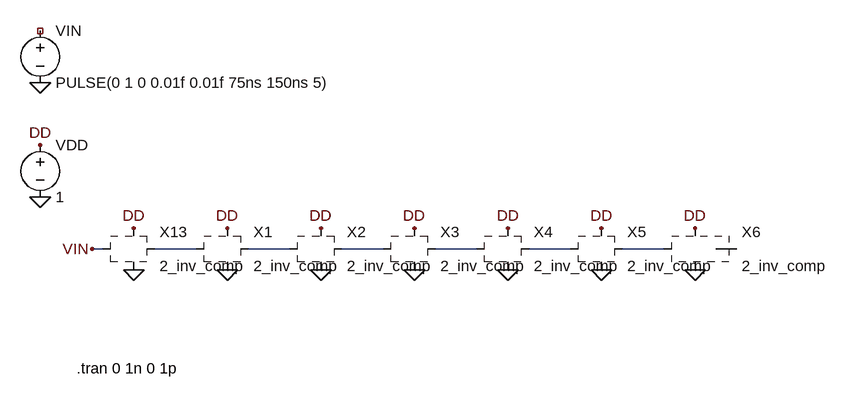
[diagram p0: schematic 2_circuito.asc]
2_circuito.asc, the LTspice schematic file:
Version 4
SHEET 1 1164 680
WIRE -144 -32 -160 -32
WIRE 0 -32 -64 -32
WIRE 144 -32 80 -32
WIRE 288 -32 224 -32
WIRE 432 -32 368 -32
WIRE 576 -32 512 -32
WIRE 720 -32 656 -32
WIRE 832 -32 800 -32
FLAG -240 -112 0
FLAG -240 -192 DD
FLAG -96 0 0
FLAG -96 -64 DD
FLAG 48 0 0
FLAG 192 0 0
FLAG 336 0 0
FLAG 480 0 0
FLAG 624 0 0
FLAG 768 0 0
FLAG 48 -64 DD
FLAG 192 -64 DD
FLAG 336 -64 DD
FLAG 480 -64 DD
FLAG 624 -64 DD
FLAG 768 -64 DD
FLAG -240 -288 0
FLAG -160 -32 VIN
SYMBOL voltage -240 -208 R0
SYMATTR InstName VDD
SYMATTR Value 1
SYMBOL 2_inv_comp -96 -32 R0
SYMATTR InstName X13
SYMBOL 2_inv_comp 48 -32 R0
SYMATTR InstName X1
SYMBOL 2_inv_comp 192 -32 R0
SYMATTR InstName X2
SYMBOL 2_inv_comp 336 -32 R0
SYMATTR InstName X3
SYMBOL 2_inv_comp 480 -32 R0
SYMATTR InstName X4
SYMBOL 2_inv_comp 624 -32 R0
SYMATTR InstName X5
SYMBOL 2_inv_comp 768 -32 R0
SYMATTR InstName X6
SYMBOL voltage -240 -384 R0
WINDOW 123 0 0 Left 2
WINDOW 39 0 0 Left 2
SYMATTR InstName VIN
SYMATTR Value PULSE(0 1 0 0.01f 0.01f 75ns 150ns 5)
TEXT -184 152 Left 2 !.tran 0 1n 0 1p

The netlist it stands for:
* 2_circuito.asc
VDD DD 0 1
* X13: 2_inv_comp (symbol 2_inv_comp not available, pin order unknown); nets seen at it: 0, DD, N001, VIN
* X1: 2_inv_comp (symbol 2_inv_comp not available, pin order unknown); nets seen at it: 0, DD, N001, N002
* X2: 2_inv_comp (symbol 2_inv_comp not available, pin order unknown); nets seen at it: 0, DD, N002, N003
* X3: 2_inv_comp (symbol 2_inv_comp not available, pin order unknown); nets seen at it: 0, DD, N003, N004
* X4: 2_inv_comp (symbol 2_inv_comp not available, pin order unknown); nets seen at it: 0, DD, N004, N005
* X5: 2_inv_comp (symbol 2_inv_comp not available, pin order unknown); nets seen at it: 0, DD, N005, N006
* X6: 2_inv_comp (symbol 2_inv_comp not available, pin order unknown); nets seen at it: 0, DD, N006, N007
VIN NC_01 0 PULSE(0 1 0 0.01f 0.01f 75ns 150ns 5)
.tran 0 1n 0 1p
.backanno
.end